# Altium project PCB_Connections.PrjPcb
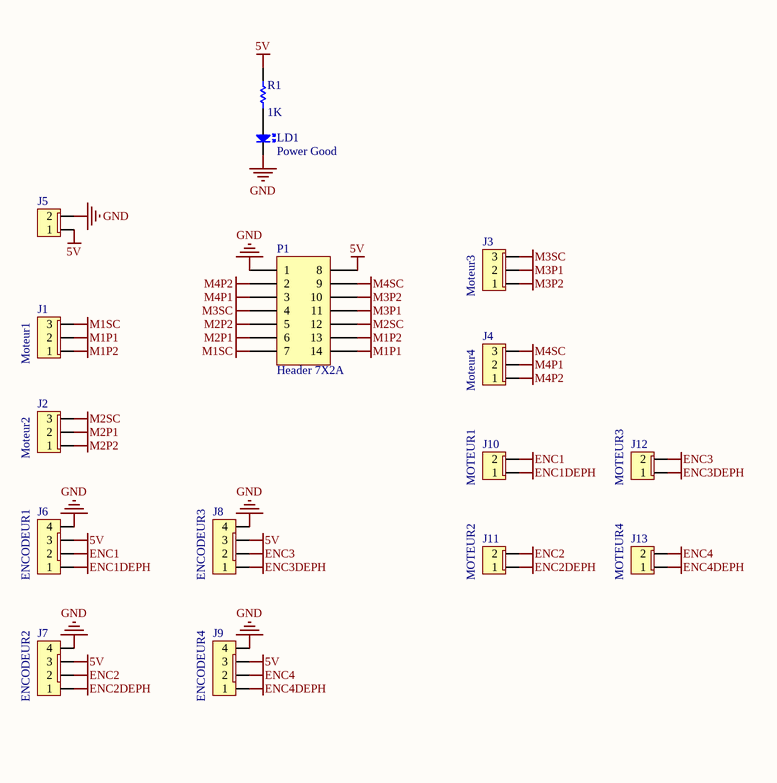
[diagram p0: Connections.SchDoc]
1 sheet, 16 parts. Net scope: global (net labels, ports and power ports of the same name join across sheets).
Board file: PCB_Connections.PcbDoc

## Sheet Connections.SchDoc
size A4

### Parts
J1  Moteur1  [MTA100-3 M]
J2  Moteur2  [MTA100-3 M]
J3  Moteur3  [MTA100-3 M]
J4  Moteur4  [MTA100-3 M]
J5  Input  [MTA100-2]  (value not drawn)
J6  ENCODEUR1  [MTA100-4 MF]
J7  ENCODEUR2  [MTA100-4 MF]
J8  ENCODEUR3  [MTA100-4 MF]
J9  ENCODEUR4  [MTA100-4 MF]
J10  MOTEUR1  [MTA100-2]
J11  MOTEUR2  [MTA100-2]
J12  MOTEUR3  [MTA100-2]
J13  MOTEUR4  [MTA100-2]
LD1  Power Good  [LED 3mm Vertical]
P1  Header 7X2A  [HDR2X7_CEN]
R1  value 1K  [AXIAL-0.3]  (hidden comment: Res1)

### Nets
5V: J5.1 J6.3 J7.3 J8.3 J9.3 P1.8 R1.2
ENC1: J6.2 J10.2
ENC1DEPH: J6.1 J10.1
ENC2: J7.2 J11.2
ENC2DEPH: J7.1 J11.1
ENC3: J8.2 J12.2
ENC3DEPH: J8.1 J12.1
ENC4: J9.2 J13.2
ENC4DEPH: J9.1 J13.1
GND: J5.2 J6.4 J7.4 J8.4 J9.4 LD1.2(K) P1.1
M1P1: J1.2 P1.14
M1P2: J1.1 P1.13
M1SC: J1.3 P1.7
M2P1: J2.2 P1.6
M2P2: J2.1 P1.5
M2SC: J2.3 P1.12
M3P1: J3.2 P1.11
M3P2: J3.1 P1.10
M3SC: J3.3 P1.4
M4P1: J4.2 P1.3
M4P2: J4.1 P1.2
M4SC: J4.3 P1.9
NetLD1_1: LD1.1(A) R1.1

### Library data of the parts
J1-J4 = MTA100-3: MTA Male 0 Degres; Comments 1: Input from; Comments 2: To; Connector Type: MTA100-3
J5 J10-J13 = MTA100-2: MTA Male 0 Degres
  J5: Connector Type: MTA100-2
J6-J9 = MTA100-4: MTA100-4M; Connector Type: MTA100-4
LD1 = LED 3mm Vertical: Through Hole; Published: 8-Jun-2000; LatestRevisionDate: 08-Jul-2005; LatestRevisionNote: Mech Layer 1 removed.; PackageReference: LED-1; Publisher: Altium Limited; PackageDescription: LED; 2 Leads; Comment_1: LED 3mm Vertical
P1 = Header 7X2A: Header, 7-Pin, Dual row; LatestRevisionDate: 17-Jul-2002; LatestRevisionNote: Re-released for DXP Platform.; Publisher: Altium Limited
R1 = Res1: Resistor; Published: 8-Jun-2000; LatestRevisionDate: 17-Jul-2002; LatestRevisionNote: Re-released for DXP Platform.; PackageReference: AXIAL-0.3; Publisher: Altium Limited; PackageDescription: Axial Device, Thru-Hole; 2 Leads; 0.3 in Pin Spacing